# EAGLE design Adafruit DS2413 (EAGLE 6.3)
COMPANY: ADAFRUIT INDUSTRIES; DRAWN: K. TOWNSEND; REV: A
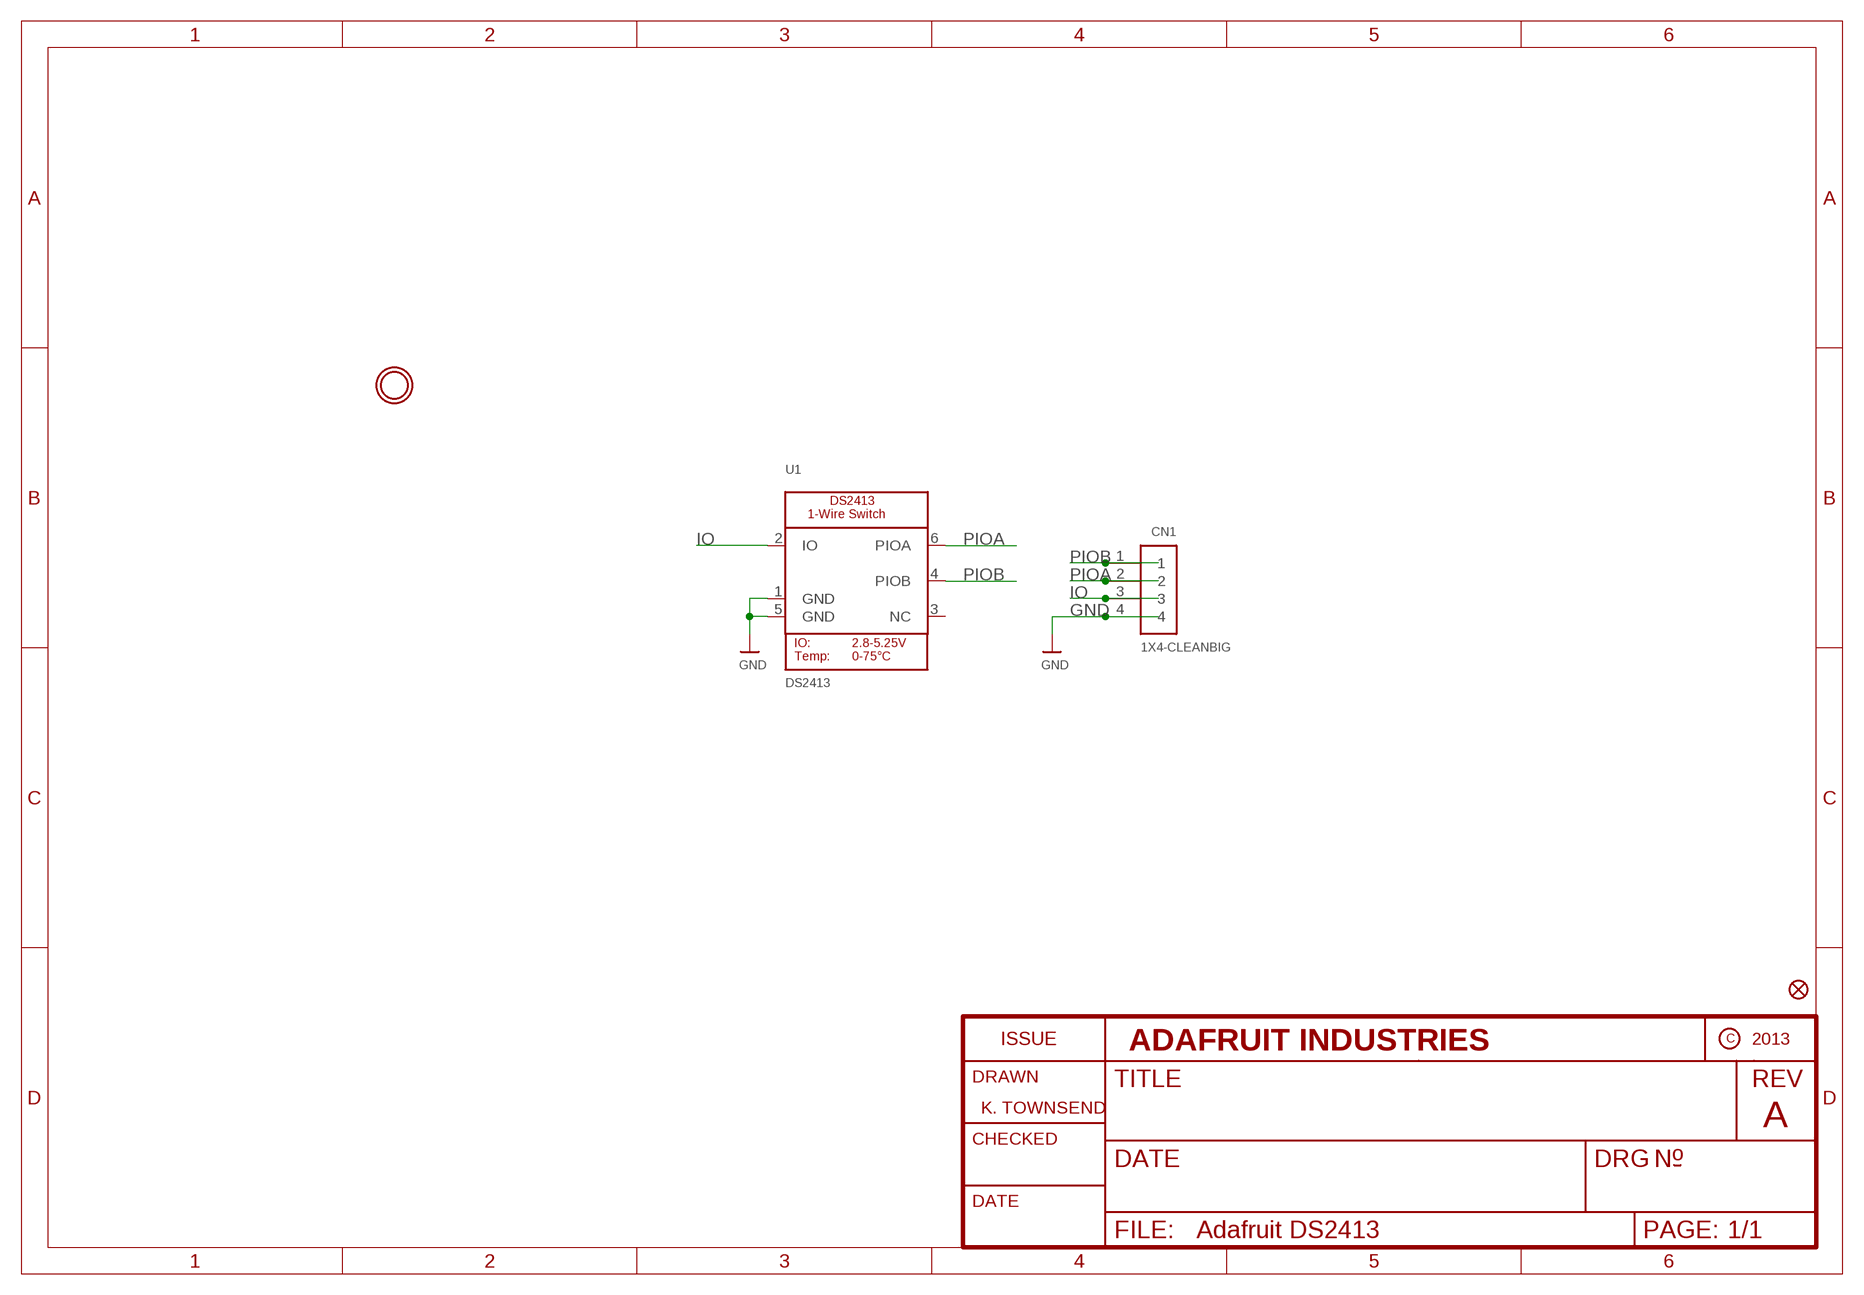
[diagram p0: schematic, sheet 1]

## Parts
CN1  1X4-CLEANBIG  [1X04-CLEANBIG]
FID1  FIDUCIAL""  [FIDUCIAL_1MM]
U1  DS2413  DS2413TSOC  [DS2413_TSOC6L]
U$4  MOUNTINGHOLE2.5  [MOUNTINGHOLE_2.5_PLATED]

## Nets
GND: CN1.4 U1.1(GND) U1.5(GND)
IO: CN1.3 U1.2(IO)
PIOA: CN1.2 U1.6(PIOA)
PIOB: CN1.1 U1.4(PIOB)
Unconnected: U1.3(NC)

## Library data of the parts
CN1 = adafruit:1X4: 4-pin connector
FID1 = microbuilder:FIDUCIAL: Fiducial Alignment Points Various fiducial points for machine vision alignment.; BOM: EXCLUDE
U1 = microbuilder:DS2413: DS2413 1-Wire Dual Channel Addressable Switch
U$4 = microbuilder:MOUNTINGHOLE: Mounting Hole For #2 screws (0.086"/2.18mm width, 0.094"/2.4mm hole) use 2.5mm; BOM: EXCLUDE

## Board
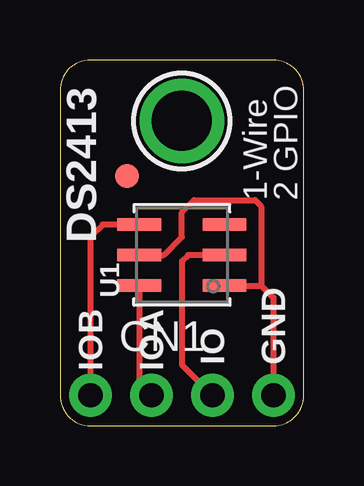
[diagram p1: board, top side]
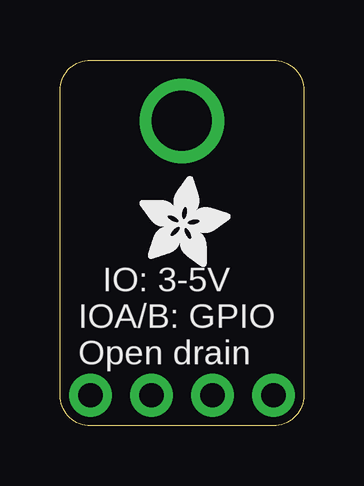
[diagram p2: board, bottom side, seen from below]

Size 10.16 x 15.24 mm. Coordinates in mm from the lower left corner, seen from the top.
Outline: 0,13.97 0,1.27 arc90 1.27,0 8.89,0 arc90 10.16,1.27 10.16,13.97 arc90 8.89,15.24 1.27,15.24 arc90 0,13.97
Copper layers (1*16): Top 0.035mm / dielectric 1.5mm / Bottom 0.035mm
Design rules "adafruit": minimum track width 8mil, minimum drill 15.5mil, track to track 8mil, track to pad 8mil, pad to pad 8mil, via to via 8mil, smd to smd 8mil, copper to edge 10mil, drill to drill 8mil, minimum pad ring 10mil, minimum via ring 8mil, stop-mask expansion 4mil, vias tented up to drill 20mil, thermal gap 10mil

### Footprints (pad centres in the part's own frame; a part is rotated, then mirrored left to right if it is on the bottom)
1X04-CLEANBIG = drill 1.016 pad 1.778: 1 -3.81,0; 2 -1.27,0; 3 1.27,0; 4 3.81,0
FIDUCIAL_1MM = smd 1 x 1: 1 0,0
DS2413_TSOC6L = smd 0.53 x 1.83: 1 1.27,1.775; 2 0,1.775; 3 -1.27,1.775; 4 -1.27,-1.775; 5 0,-1.775; 6 1.27,-1.775
MOUNTINGHOLE_2.5_PLATED = drill 2.5 pad 3.2: P$1 0,0

### Placement (x,y rotation side)
CN1  5.08,1.27 0 top
FID1  2.79,10.41 0 top
U1  5.08,7.11 270 top
U$3  [ADAFRUIT_3.5MM]  6.86,6.6 0 bottom
U$4  5.08,12.7 0 top

### Tracks (layer width: path | path; a pad name or v marks a point on that pad's centre or on a via)
GND
  Top 0.254: U1.1 8.38,5.84 | 8.38,5.84 8.89,5.33 CN1.4 | U1.5 4.32,7.11 5.08,7.87 5.08,8.89 5.59,9.4 8.13,9.4 8.38,9.14 8.38,5.84
IO
  Top 0.254: U1.2 5.33,7.11 5.08,6.86 5.08,2.54 CN1.3
PIOA
  Top 0.254: U1.6 3.31,1.77 CN1.2
PIOB
  Top 0.254: U1.4 1.78,8.38 1.27,7.87 CN1.1

### Text on the board
tPlace: 1-Wire | 2 GPIO | DS2413 | IO | GND | IOB | IOA
bPlace: IO: 3-5V | IOA/B: GPIO / Open drain